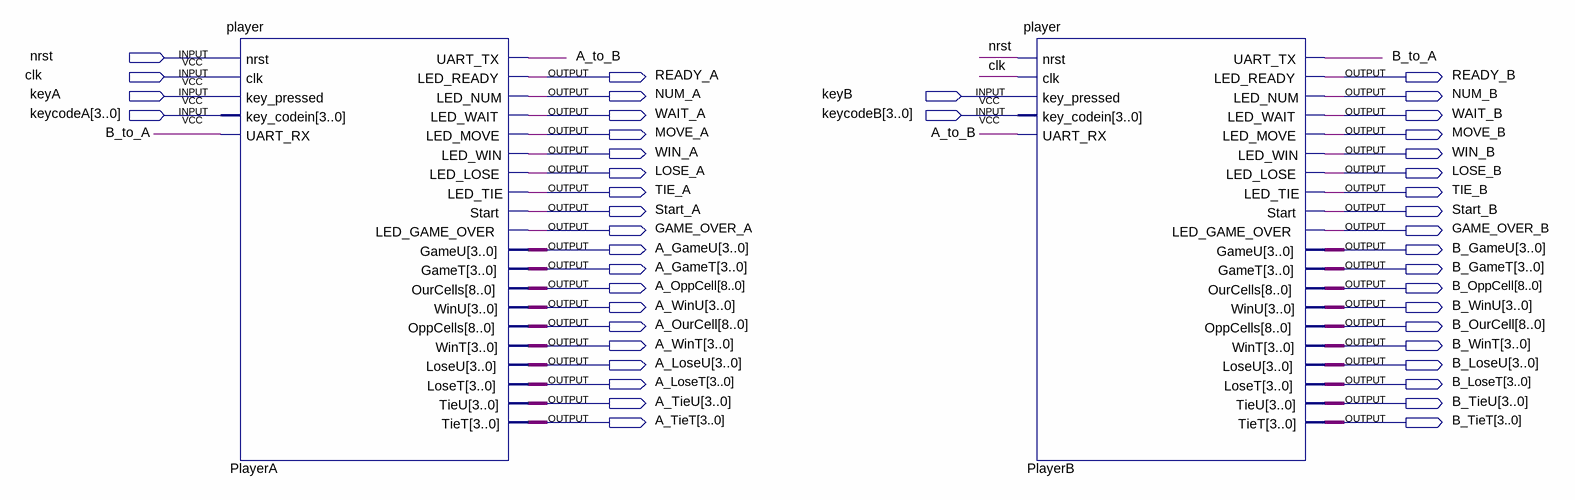
[diagram p0: schematic sheet]
// Quartus schematic Simulation_Two_Players.bdf as structural Verilog: 2 symbols, 44 pins
module Simulation_Two_Players (
  input  nrst,
  input  clk,
  input  keyA,
  input  keyB,
  input  [3:0] keycodeA,
  input  [3:0] keycodeB,
  output READY_A,
  output READY_B,
  output NUM_A,
  output NUM_B,
  output WAIT_A,
  output WAIT_B,
  output MOVE_A,
  output MOVE_B,
  output WIN_A,
  output WIN_B,
  output LOSE_A,
  output LOSE_B,
  output TIE_A,
  output TIE_B,
  output Start_A,
  output Start_B,
  output GAME_OVER_A,
  output GAME_OVER_B,
  output [3:0] A_GameU,
  output [3:0] B_GameU,
  output [3:0] A_GameT,
  output [3:0] B_GameT,
  output [8:0] A_OppCell,
  output [8:0] B_OppCell,
  output [3:0] A_WinU,
  output [3:0] B_WinU,
  output [8:0] A_OurCell,
  output [8:0] B_OurCell,
  output [3:0] A_WinT,
  output [3:0] B_WinT,
  output [3:0] A_LoseU,
  output [3:0] B_LoseU,
  output [3:0] A_LoseT,
  output [3:0] B_LoseT,
  output [3:0] A_TieU,
  output [3:0] B_TieU,
  output [3:0] A_TieT,
  output [3:0] B_TieT
);

  wire A_to_B, B_to_A;

  player PlayerA (
    .nrst(nrst), .clk(clk), .key_pressed(keyA), .key_codein(keycodeA), .UART_RX(B_to_A), .UART_TX(A_to_B),
    .LED_READY(READY_A), .LED_NUM(NUM_A), .LED_WAIT(WAIT_A), .LED_MOVE(MOVE_A), .LED_WIN(WIN_A),
    .LED_LOSE(LOSE_A), .LED_TIE(TIE_A), .Start(Start_A), .LED_GAME_OVER(GAME_OVER_A), .GameU(A_GameU),
    .GameT(A_GameT), .OurCells(A_OppCell), .WinU(A_WinU), .OppCells(A_OurCell), .WinT(A_WinT),
    .LoseU(A_LoseU), .LoseT(A_LoseT), .TieU(A_TieU), .TieT(A_TieT));
  player PlayerB (
    .nrst(nrst), .clk(clk), .key_pressed(keyB), .key_codein(keycodeB), .UART_RX(A_to_B), .UART_TX(B_to_A),
    .LED_READY(READY_B), .LED_NUM(NUM_B), .LED_WAIT(WAIT_B), .LED_MOVE(MOVE_B), .LED_WIN(WIN_B),
    .LED_LOSE(LOSE_B), .LED_TIE(TIE_B), .Start(Start_B), .LED_GAME_OVER(GAME_OVER_B), .GameU(B_GameU),
    .GameT(B_GameT), .OurCells(B_OppCell), .WinU(B_WinU), .OppCells(B_OurCell), .WinT(B_WinT),
    .LoseU(B_LoseU), .LoseT(B_LoseT), .TieU(B_TieU), .TieT(B_TieT));
endmodule
